# EAGLE design Master Volume 1.0 (EAGLE 7.2.0)
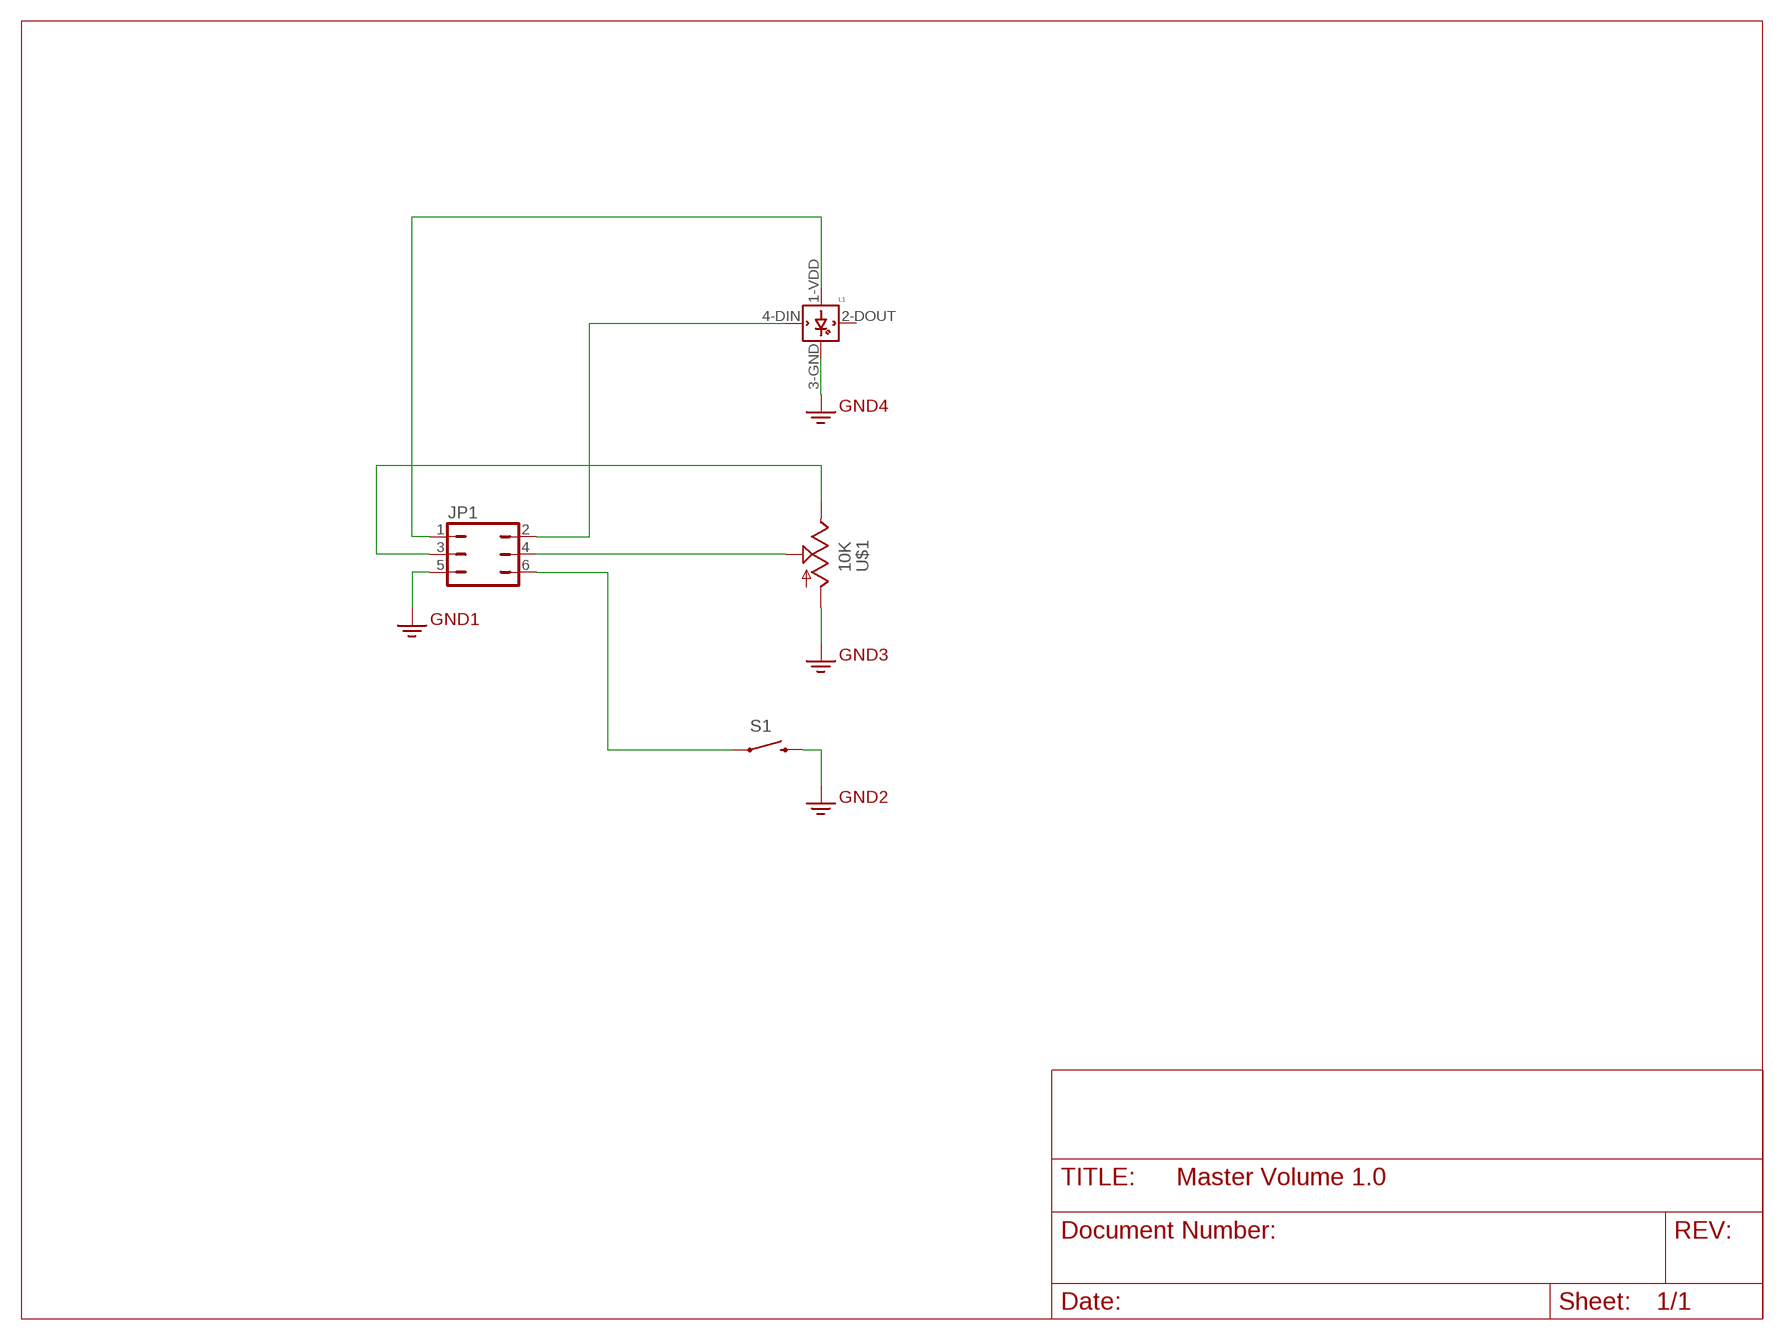
[diagram p0: schematic, sheet 1]

## Parts
JP1  Master Volume  JP3Q  [JP3Q]
L1  WS2812B  [WS2812B]
S1  SWITCH-MOMENTARY-2SMD  [TACTILE-SWITCH-SMD]
U$1  10K  ALPHA1400F10K  [14MMPOT]

## Nets
GND: JP1.5 L1.3-GND(GND) S1.3 U$1.P$5(A) ; supply symbol labelled GND2
N$1: JP1.1 L1.1-VDD(VDD)
N$2: JP1.3 U$1.P$4(E)
N$3: JP1.2 L1.4-DIN(DIN)
N$4: JP1.4 U$1.P$3(S)
N$5: JP1.6 S1.1
Unconnected: L1.2-DOUT(DOUT)

## Library data of the parts
JP1 = SynthLib:JP3Q: JUMPER
L1 = SynthLib:WS2812B
S1 = SynthLib:SWITCH-MOMENTARY-2: Various NO switches- pushbuttons, reed, etc; PROD_ID: SWCH-08247
U$1 = SynthLib:ALPHA1400F: Alpha 1400F series clear shaft potentiometer

## Board
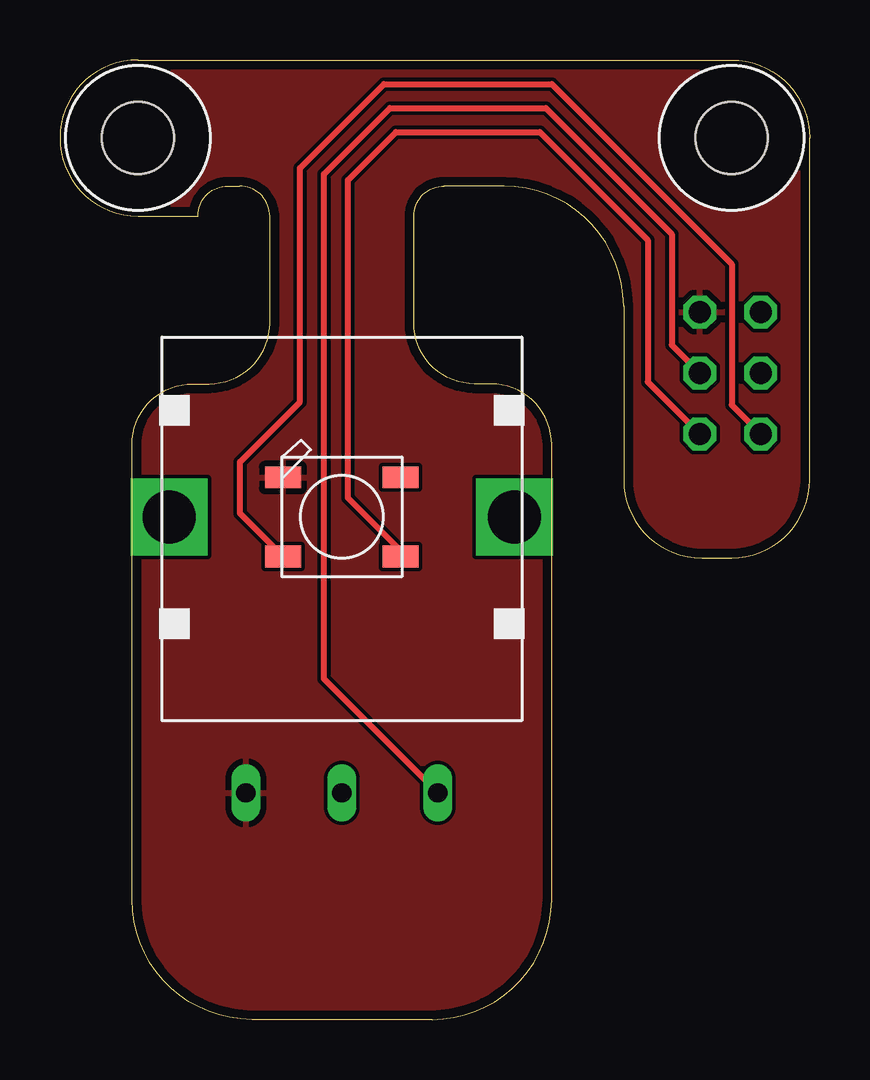
[diagram p1: board, top side]
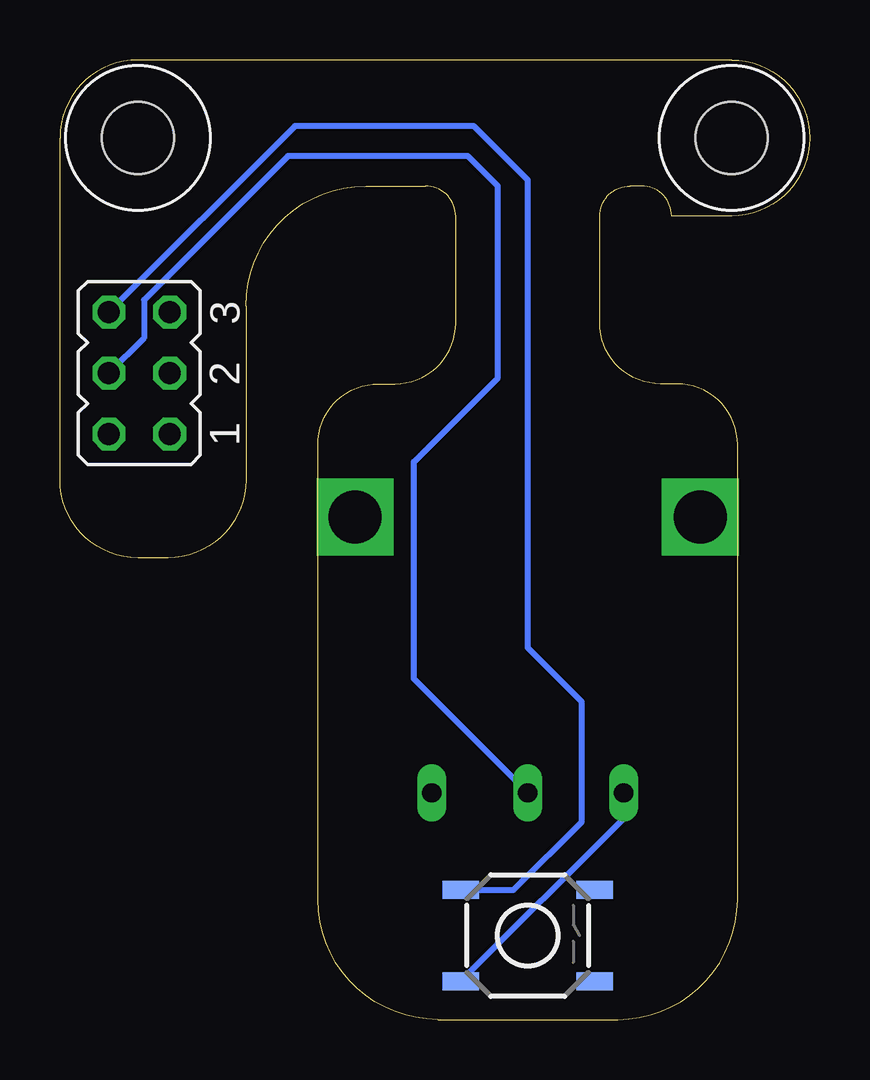
[diagram p2: board, bottom side, seen from below]

Size 31.25 x 40 mm. Coordinates in mm from the lower left corner, seen from the top.
Outline: 3.25,40 arc90 0,36.75 arc90 3.25,33.5 5.75,33.5 arc-90 7,34.75 7.48,34.75 arc-90 8.75,33.48 8.75,29.04 arc-90 6.21,26.5 5.54,26.5 arc90 3,23.96 3,5 arc90 8,0 15.5,0 arc90 20.5,5 20.5,23.96 arc90 17.96,26.5 17.29,26.5 arc-90 14.75,29.04 14.75,33.48 arc-90 16.02,34.75 18.5,34.75 arc-90 23.5,29.75 23.5,22.5 arc90 26.75,19.25 28,19.25 arc90 31.25,22.5 31.25,36.75 arc90 28,40 3.25,40
Copper layers (1*16): Top 0.0356mm / dielectric 1.5011mm / Bottom 0.0356mm
Design rules "LaenPCBOrder *": minimum track width 6mil, minimum drill 13mil, track to track 6mil, track to pad 6mil, pad to pad 6mil, via to via 6mil, smd to smd 6mil, copper to edge 15mil, drill to drill 6mil, minimum pad ring 7mil, minimum via ring 7mil, stop-mask expansion 3mil, vias tented up to drill 0mil, thermal gap 10mil

### Footprints (pad centres in the part's own frame; a part is rotated, then mirrored left to right if it is on the bottom)
JP3Q = drill 0.914 octagon: 1 -2.54,-1.27; 2 -2.54,1.27; 3 0,-1.27; 4 0,1.27; 5 2.54,-1.27; 6 2.54,1.27
WS2812B = smd 1.5 x 0.9: 1-VDD 2.45,-1.65; 2-DOUT 2.45,1.65; 3-GND -2.45,1.65; 4-DIN -2.45,-1.65
TACTILE-SWITCH-SMD = smd 1.524 x 0.762: 1 -2.794,1.905; 2 2.794,1.905; 3 -2.794,-1.905; 4 2.794,-1.905
14MMPOT = drill 2.2 square: P$1 -7.2,0; P$2 7.2,0 | drill 0.8 long: P$3 0,-11.5; P$4 4,-11.5; P$5 -4,-11.5
STANDOFF-M3 = hole 3: 0,0

### Placement (x,y rotation side)
JP1  27.94,26.95 90 bottom
L1  11.75,20.95 0 top
S1  11.75,3.5 0 bottom
U$1  11.75,20.95 0 top
U$2  [STANDOFF-M3]  3.25,36.75 0 top
U$3  [STANDOFF-M3]  28,36.75 0 top

### Tracks (layer width: path | path; a pad name or v marks a point on that pad's centre or on a via)
GND
  Bottom 0.254: U$1.P$5 7.75,8.39 S1.3
  pour Top: 0.25,-4.25 -1,41.5 33.75,41.5 33.75,36.5 33.75,-4 0.5,-4
N$1
  Top 0.254: L1.1-VDD 14.2,19.45 14.25,19.5 12,21.75 12,35 14,37 20,37 24.5,32.5 24.5,26.58 JP1.1
N$2
  Top 0.254: U$1.P$4 11,14.2 11,35.25 13.75,38 20.25,38 25.5,32.75 25.5,28.12 JP1.3
N$3
  Top 0.254: L1.4-DIN 7.5,21.1 7.5,23.25 10,25.75 10,35.5 13.5,39 20.5,39 28,31.5 28,25.62 JP1.2
N$4
  Bottom 0.254: U$1.P$3 16.5,14.2 16.5,23.25 13,26.75 13,34.75 14.25,36 21.75,36 27.75,30 27.75,28.41 JP1.4
N$5
  Bottom 0.254: S1.1 12.35,5.4 9.5,8.25 9.5,13.25 11.75,15.5 11.75,35 14,37.25 21.45,37.25 JP1.6